# EAGLE design RS485 Extension Board (EAGLE 7.5.0)
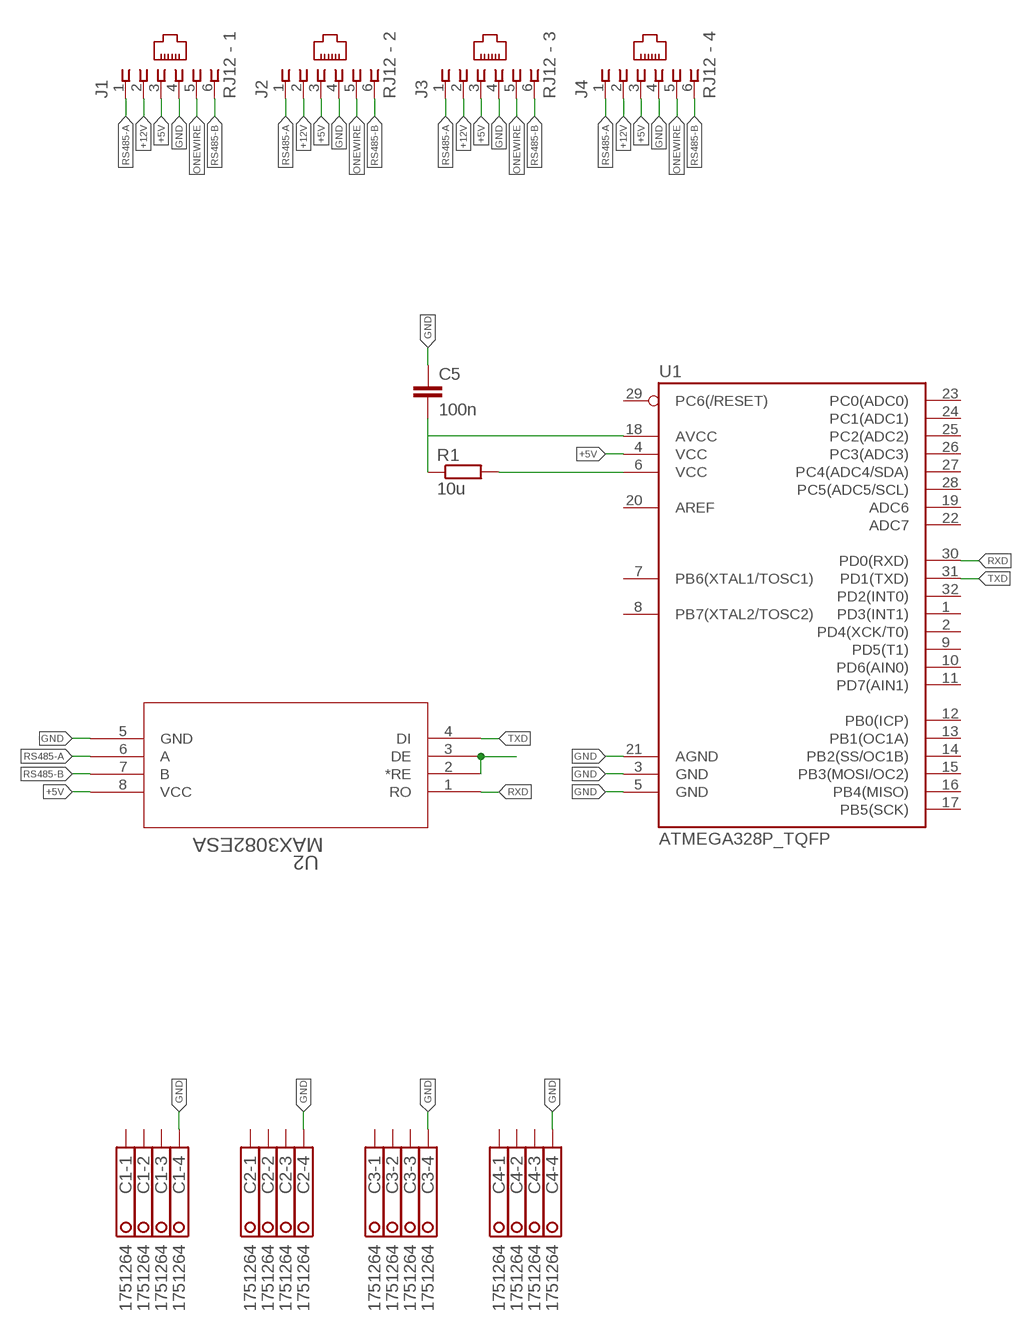
[diagram p0: schematic, sheet 1]

## Parts
C1  1751264  [1751264]
C2  1751264  [1751264]
C3  1751264  [1751264]
C4  1751264  [1751264]
C5  100n  C-EUC0805  [C0805]
J1  RJ12 - 1  520250-3  [520250-3]
J2  RJ12 - 2  520250-3  [520250-3]
J3  RJ12 - 3  520250-3  [520250-3]
J4  RJ12 - 4  520250-3  [520250-3]
R1  10u  R-EU_M0805  [M0805]
U1  ATMEGA328P_TQFP  [TQFP32-08]
U2  MAX3082ESA  [21-0041B_8]

## Nets
+5V: C5.2 J1.3 J2.3 J3.3 J4.3 R1.1 U1.4(VCC) U1.18(AVCC) U2.8(VCC)
+12V: J1.2 J2.2 J3.2 J4.2
GND: C1.4 C2.4 C3.4 C4.4 C5.1 J1.4 J2.4 J3.4 J4.4 U1.3(GND) U1.5(GND) U1.21(AGND) U2.5(GND)
N$1: U2.2(*RE) U2.3(DE)
N$2: R1.2 U1.6(VCC)
ONEWIRE: J1.5 J2.5 J3.5 J4.5
RS485-A: J1.1 J2.1 J3.1 J4.1 U2.6(A)
RS485-B: J1.6 J2.6 J3.6 J4.6 U2.7(B)
RXD: U1.30(PD0(RXD)) U2.1(RO)
TXD: U1.31(PD1(TXD)) U2.4(DI)
Unconnected: C1.1 C1.2 C1.3 C2.1 C2.2 C2.3 C3.1 C3.2 C3.3 C4.1 C4.2 C4.3 U1.1(PD3(INT1)) U1.2(PD4(XCK/T0)) U1.7(PB6(XTAL1/TOSC1)) U1.8(PB7(XTAL2/TOSC2)) U1.9(PD5(T1)) U1.10(PD6(AIN0)) U1.11(PD7(AIN1)) U1.12(PB0(ICP)) U1.13(PB1(OC1A)) U1.14(PB2(SS/OC1B)) U1.15(PB3(MOSI/OC2)) U1.16(PB4(MISO)) U1.17(PB5(SCK)) U1.19(ADC6) U1.20(AREF) U1.22(ADC7) U1.23(PC0(ADC0)) U1.24(PC1(ADC1)) U1.25(PC2(ADC2)) U1.26(PC3(ADC3)) U1.27(PC4(ADC4/SDA)) U1.28(PC5(ADC5/SCL)) U1.29(PC6(/RESET)) U1.32(PD2(INT0))

## Library data of the parts
C1-C4 = con-phoenix-350:1751264: MKDS 1/ 4-3,5 Printklemme Nennstrom: 10 A Bemessungsspannung: 160 V Raster: 3,5 mm Polzahl: 4 Montageart: Löten Anschlussart: Schraubanschluss Anschlussrichtung vom Leiter zur Platine: 0° Source: http://eshop.phoenixcontact.com .. 1751264.pdf; MPN: 1751264; OC_FARNELL: unknown; OC_NEWARK: 10R0934
C5 = rcl:C-EU: CAPACITOR, European symbol
J1-J4 = con-amp:520250-3: AMP connector
R1 = rcl:R-EU_: RESISTOR, European symbol
U1 = SparkFun-DigitalIC:ATMEGA328P_TQFP; PROD_ID: IC-09069
U2 = MAX3082ESA:MAX3082ESA; MANUFACTURER_NAME: Maxim; MANUFACTURER_PART_NUMBER: MAX3082ESA; VENDOR: Maxim

## Board
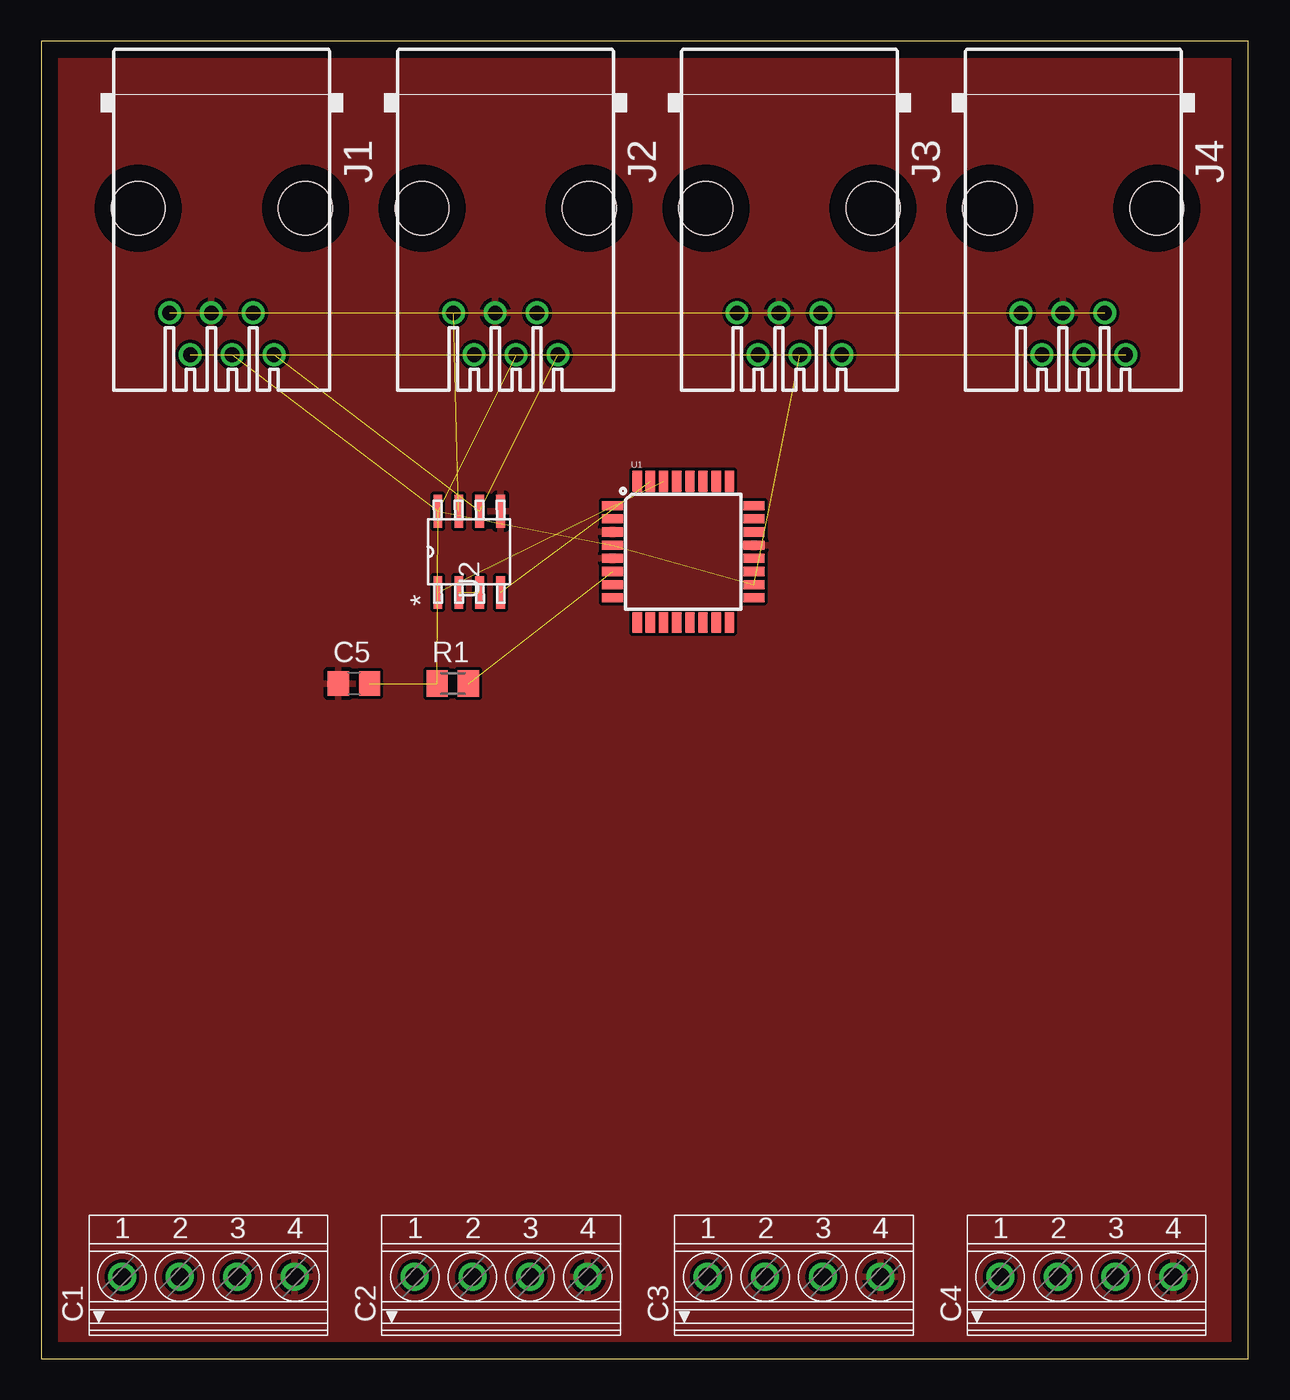
[diagram p1: board, top side]
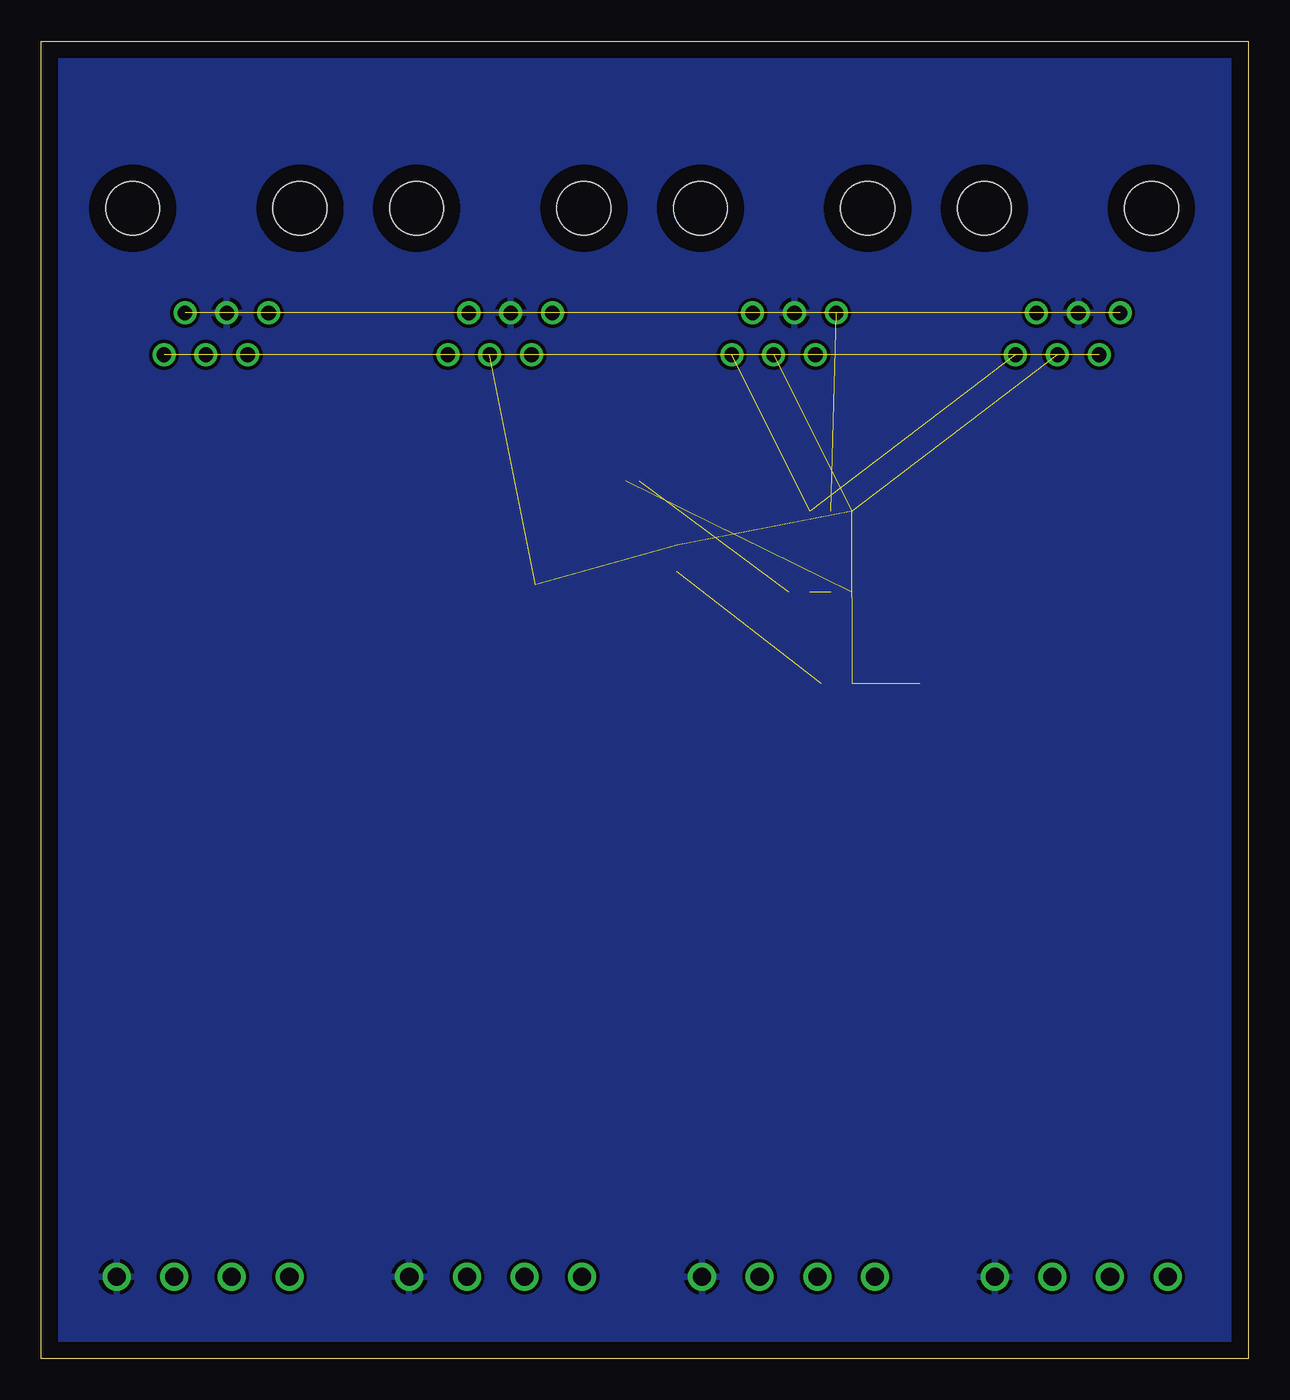
[diagram p2: board, bottom side, seen from below]

Size 73.33 x 80 mm. Coordinates in mm from the lower left corner, seen from the top.
Outline: 0,0 73.33,0 73.33,80 0,80 0,0
Copper layers (1*16): Top 0.035mm / dielectric 1.5mm / Bottom 0.035mm
Design rules "default": minimum track width 10mil, minimum drill 24mil, track to track 8mil, track to pad 8mil, pad to pad 8mil, via to via 8mil, smd to smd 8mil, copper to edge 40mil, drill to drill 8mil, minimum pad ring 10mil, minimum via ring 8mil, stop-mask expansion 4mil, vias tented up to drill 0mil, thermal gap 10mil

### Footprints (pad centres in the part's own frame; a part is rotated, then mirrored left to right if it is on the bottom)
1751264 = drill 1.1 pad 1.7: 1 -5.25,-0.1; 2 -1.75,-0.1; 3 1.75,-0.1; 4 5.25,-0.1
C0805 = smd 1.3 x 1.5: 1 -0.95,0; 2 0.95,0
520250-3 = drill 0.889: 1 -3.175,8.89; 2 -1.905,6.35; 3 -0.635,8.89; 4 0.635,6.35; 5 1.905,8.89; 6 3.175,6.35 | hole 3.251: -5.08,0; 5.08,0
M0805 = smd 1.3 x 1.6: 1 -0.95,0; 2 0.95,0
TQFP32-08 = smd 1.27 x 0.559: 1 -4.293,2.8; 2 -4.293,2; 3 -4.293,1.2; 4 -4.293,0.4; 5 -4.293,-0.4; 6 -4.293,-1.2; 7 -4.293,-2; 8 -4.293,-2.8; 17 4.293,-2.8; 18 4.293,-2; 19 4.293,-1.2; 20 4.293,-0.4; 21 4.293,0.4; 22 4.293,1.2; 23 4.293,2; 24 4.293,2.8 | smd 0.559 x 1.27: 9 -2.8,-4.293; 10 -2,-4.293; 11 -1.2,-4.293; 12 -0.4,-4.293; 13 0.4,-4.293; 14 1.2,-4.293; 15 2,-4.293; 16 2.8,-4.293; 25 2.8,4.293; 26 2,4.293; 27 1.2,4.293; 28 0.4,4.293; 29 -0.4,4.293; 30 -1.2,4.293; 31 -2,4.293; 32 -2.8,4.293
21-0041B_8 = smd 1.981 x 0.533: 1 -2.464,1.905; 2 -2.464,0.635; 3 -2.464,-0.635; 4 -2.464,-1.905; 5 2.464,-1.905; 6 2.464,-0.635; 7 2.464,0.635; 8 2.464,1.905

### Placement (x,y rotation side)
C1  10.16,5.08 0 top
C2  27.94,5.08 0 top
C3  45.72,5.08 0 top
C4  63.5,5.08 0 top
C5  19,41 0 top
J1  10.97,69.85 180 top
J2  28.21,69.85 180 top
J3  45.45,69.85 180 top
J4  62.69,69.85 180 top
R1  25,41 0 top
U1  39,49 0 top
U2  26,49 90 top

### Tracks (layer width: path | path; a pad name or v marks a point on that pad's centre or on a via)
+5V  (8 unrouted)
+12V  (3 unrouted)
GND
  pour Bottom: -1,81 -1,-1 74,-1 74,1 74,81
  pour Top: -1,81 -1,-1 74,-1 74,81
N$1  (1 unrouted)
N$2  (1 unrouted)
ONEWIRE  (3 unrouted)
RS485-A  (4 unrouted)
RS485-B  (4 unrouted)
RXD  (1 unrouted)
TXD  (1 unrouted)